# Altium schematic sheet [0X] - CPU - EIM.SchDoc
size A2
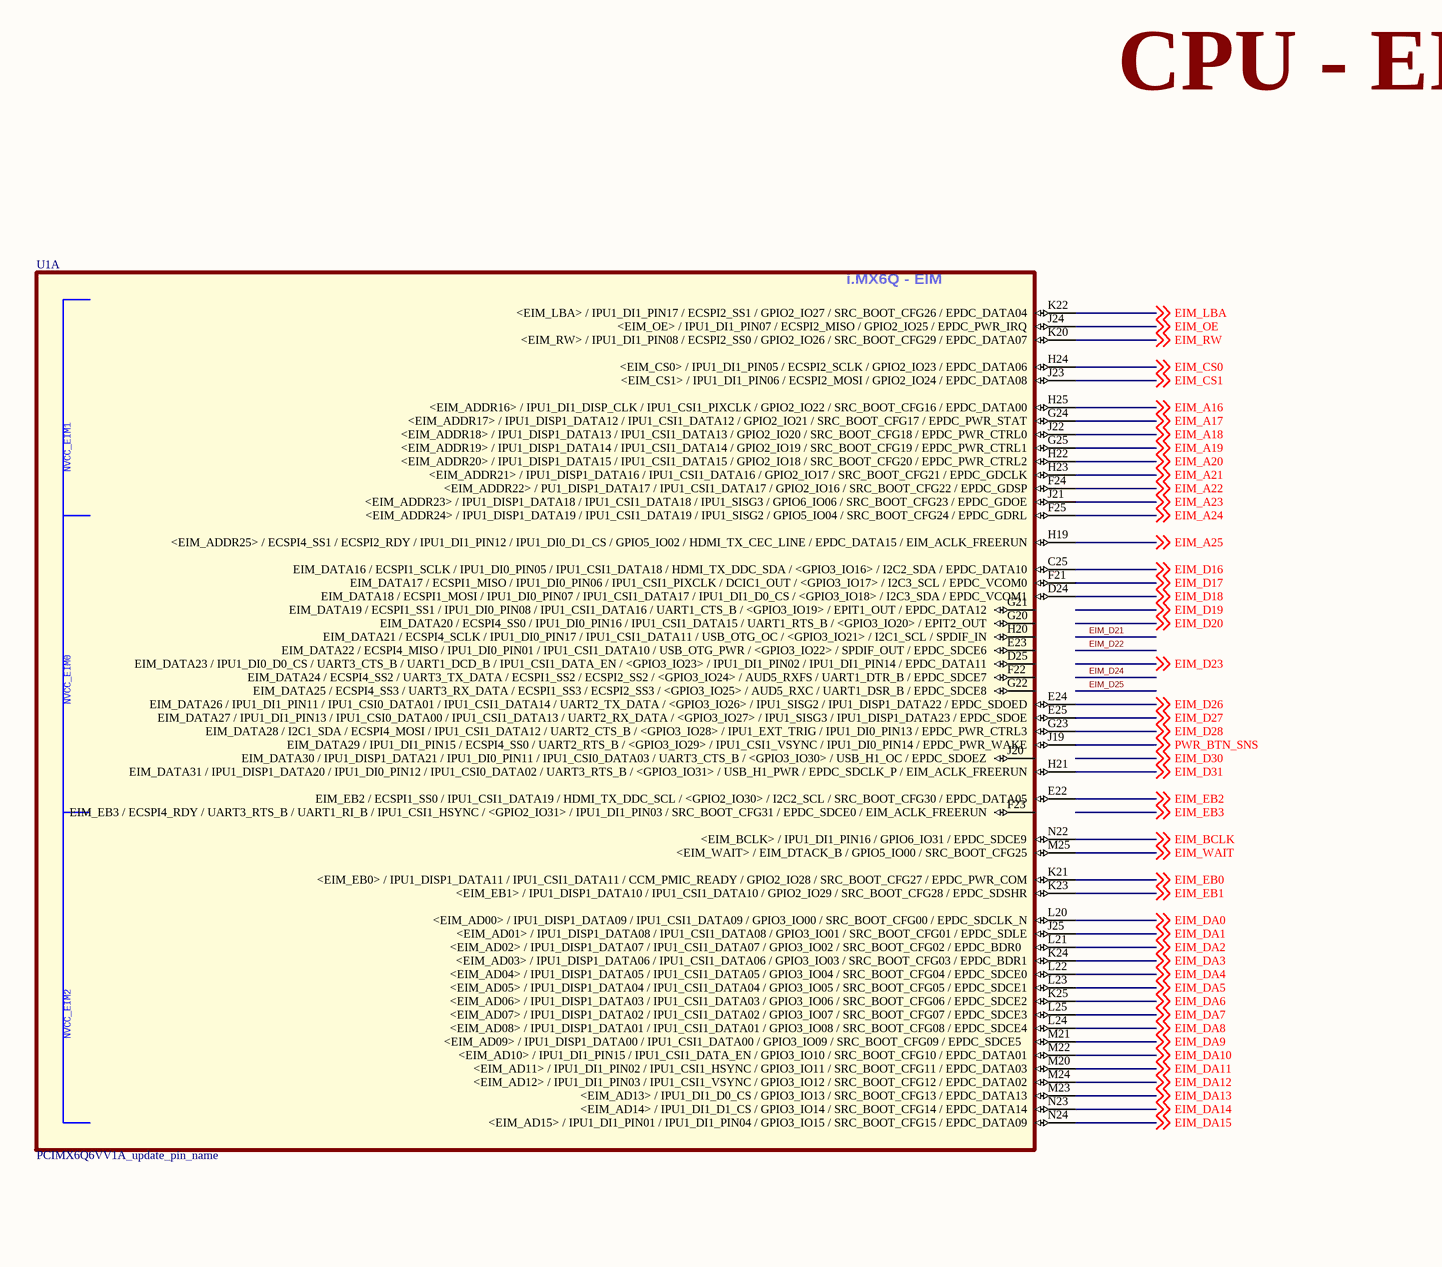
[diagram p0: [0X] - CPU - EIM.SchDoc, left]
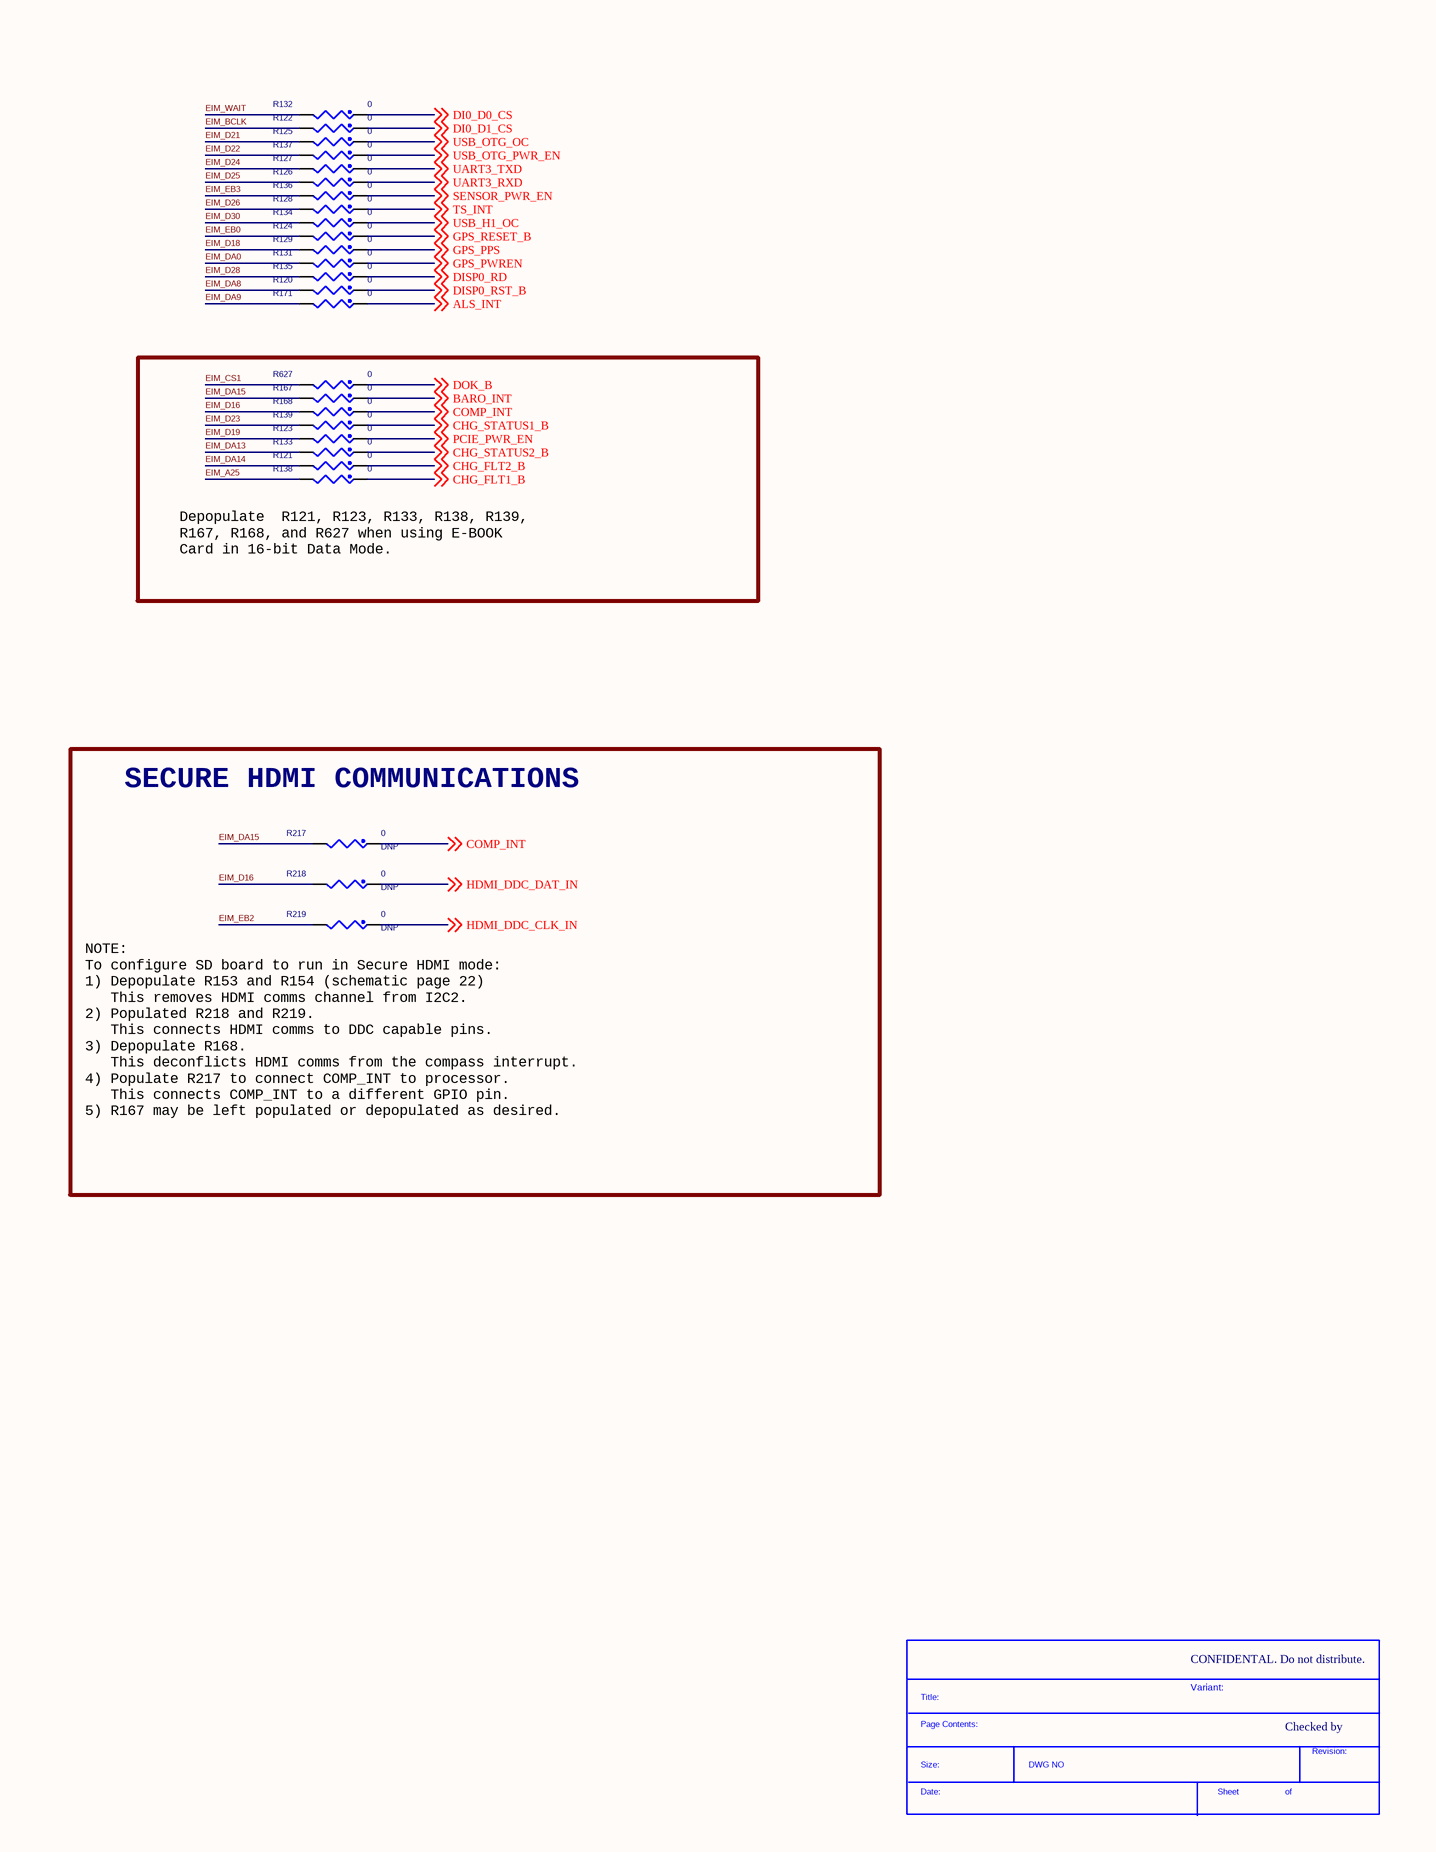
[diagram p1: [0X] - CPU - EIM.SchDoc, right]

## Parts
*  SDTitleBlock  (value not drawn)  (graphical)
R120  0  [0402_CC]
R121  0  [0402_CC]
R122  0  [0402_CC]
R123  0  [0402_CC]
R124  0  [0402_CC]
R125  0  [0402_CC]
R126  0  [0402_CC]
R127  0  [0402_CC]
R128  0  [0402_CC]
R129  0  [0402_CC]
R131  0  [0402_CC]
R132  0  [0402_CC]
R133  0  [0402_CC]
R134  0  [0402_CC]
R135  0  [0402_CC]
R136  0  [0402_CC]
R137  0  [0402_CC]
R138  0  [0402_CC]
R139  0  [0402_CC]
R167  0  [0402_CC]
R168  0  [0402_CC]
R171  0  [0402_CC]
R217  0  ASSY_OPT: DNP  [0402_CC]
R218  0  ASSY_OPT: DNP  [0402_CC]
R219  0  ASSY_OPT: DNP  [0402_CC]
R627  0  [0402_CC]
U1  PCIMX6Q6VV1A_update_pin_name  (part A of 17)

## Blocks framed on the sheet
SECURE HDMI COMMUNICATIONS: R217-R219

## Nets
ALS_INT: R171.1 ; off-sheet ALS_INT
BARO_INT: R167.1 ; off-sheet BARO_INT
CHG_FLT1_B: R138.1 ; off-sheet CHG_FLT1_B
CHG_FLT2_B: R121.1 ; off-sheet CHG_FLT2_B
CHG_STATUS1_B: R139.1 ; off-sheet CHG_STATUS1_B
CHG_STATUS2_B: R133.1 ; off-sheet CHG_STATUS2_B
COMP_INT: R168.1 R217.1 ; off-sheet COMP_INT
DI0_D0_CS: R132.1 ; off-sheet DI0_D0_CS
DI0_D1_CS: R122.1 ; off-sheet DI0_D1_CS
DISP0_RD: R135.1 ; off-sheet DISP0_RD
DISP0_RST_B: R120.1 ; off-sheet DISP0_RST_B
DOK_B: R627.1 ; off-sheet DOK_B
EIM_A16: U1.H25(<EIM_ADDR16>_/_IPU1_DI1_DISP_CLK_/_IPU1_CSI1_PIXCLK_/_GPIO2_IO22_/_SRC_BOOT_CFG16_/_EPDC_DATA00) ; off-sheet EIM_A16
EIM_A17: U1.G24(<EIM_ADDR17>_/_IPU1_DISP1_DATA12_/_IPU1_CSI1_DATA12_/_GPIO2_IO21_/_SRC_BOOT_CFG17_/_EPDC_PWR_STAT) ; off-sheet EIM_A17
EIM_A18: U1.J22(<EIM_ADDR18>_/_IPU1_DISP1_DATA13_/_IPU1_CSI1_DATA13_/_GPIO2_IO20_/_SRC_BOOT_CFG18_/_EPDC_PWR_CTRL0) ; off-sheet EIM_A18
EIM_A19: U1.G25(<EIM_ADDR19>_/_IPU1_DISP1_DATA14_/_IPU1_CSI1_DATA14_/_GPIO2_IO19_/_SRC_BOOT_CFG19_/_EPDC_PWR_CTRL1) ; off-sheet EIM_A19
EIM_A20: U1.H22(<EIM_ADDR20>_/_IPU1_DISP1_DATA15_/_IPU1_CSI1_DATA15_/_GPIO2_IO18_/_SRC_BOOT_CFG20_/_EPDC_PWR_CTRL2) ; off-sheet EIM_A20
EIM_A21: U1.H23(<EIM_ADDR21>_/_IPU1_DISP1_DATA16_/_IPU1_CSI1_DATA16_/_GPIO2_IO17_/_SRC_BOOT_CFG21_/_EPDC_GDCLK) ; off-sheet EIM_A21
EIM_A22: U1.F24(<EIM_ADDR22>_/_PU1_DISP1_DATA17_/_IPU1_CSI1_DATA17_/_GPIO2_IO16_/_SRC_BOOT_CFG22_/_EPDC_GDSP) ; off-sheet EIM_A22
EIM_A23: U1.J21(<EIM_ADDR23>_/_IPU1_DISP1_DATA18_/_IPU1_CSI1_DATA18_/_IPU1_SISG3_/_GPIO6_IO06_/_SRC_BOOT_CFG23_/_EPDC_GDOE) ; off-sheet EIM_A23
EIM_A24: U1.F25(<EIM_ADDR24>_/_IPU1_DISP1_DATA19_/_IPU1_CSI1_DATA19_/_IPU1_SISG2_/_GPIO5_IO04_/_SRC_BOOT_CFG24_/_EPDC_GDRL) ; off-sheet EIM_A24
EIM_A25: R138.2 U1.H19(<EIM_ADDR25>_/_ECSPI4_SS1_/_ECSPI2_RDY_/_IPU1_DI1_PIN12_/_IPU1_DI0_D1_CS_/_GPIO5_IO02_/_HDMI_TX_CEC_LINE_/_EPDC_DATA15_/_EIM_ACLK_FREERUN) ; off-sheet EIM_A25
EIM_BCLK: R122.2 U1.N22(<EIM_BCLK>_/_IPU1_DI1_PIN16_/_GPIO6_IO31_/_EPDC_SDCE9) ; off-sheet EIM_BCLK
EIM_CS0: U1.H24(<EIM_CS0>_/_IPU1_DI1_PIN05_/_ECSPI2_SCLK_/_GPIO2_IO23_/_EPDC_DATA06) ; off-sheet EIM_CS0
EIM_CS1: R627.2 U1.J23(<EIM_CS1>_/_IPU1_DI1_PIN06_/_ECSPI2_MOSI_/_GPIO2_IO24_/_EPDC_DATA08) ; off-sheet EIM_CS1
EIM_D16: R168.2 R218.2 U1.C25(EIM_DATA16_/_ECSPI1_SCLK_/_IPU1_DI0_PIN05_/_IPU1_CSI1_DATA18_/_HDMI_TX_DDC_SDA_/_<GPIO3_IO16>_/_I2C2_SDA_/_EPDC_DATA10) ; off-sheet EIM_D16
EIM_D17: U1.F21(EIM_DATA17_/_ECSPI1_MISO_/_IPU1_DI0_PIN06_/_IPU1_CSI1_PIXCLK_/_DCIC1_OUT_/_<GPIO3_IO17>_/_I2C3_SCL_/_EPDC_VCOM0) ; off-sheet EIM_D17
EIM_D18: R129.2 U1.D24(EIM_DATA18_/_ECSPI1_MOSI_/_IPU1_DI0_PIN07_/_IPU1_CSI1_DATA17_/_IPU1_DI1_D0_CS_/_<GPIO3_IO18>_/_I2C3_SDA_/_EPDC_VCOM1) ; off-sheet EIM_D18
EIM_D19: R123.2 ; off-sheet EIM_D19
EIM_D21: R125.2
EIM_D22: R137.2
EIM_D23: R139.2 ; off-sheet EIM_D23
EIM_D24: R127.2
EIM_D25: R126.2
EIM_D26: R128.2 U1.E24(EIM_DATA26_/_IPU1_DI1_PIN11_/_IPU1_CSI0_DATA01_/_IPU1_CSI1_DATA14_/_UART2_TX_DATA_/_<GPIO3_IO26>_/_IPU1_SISG2_/_IPU1_DISP1_DATA22_/_EPDC_SDOED) ; off-sheet EIM_D26
EIM_D27: U1.E25(EIM_DATA27_/_IPU1_DI1_PIN13_/_IPU1_CSI0_DATA00_/_IPU1_CSI1_DATA13_/_UART2_RX_DATA_/_<GPIO3_IO27>_/_IPU1_SISG3_/_IPU1_DISP1_DATA23_/_EPDC_SDOE) ; off-sheet EIM_D27
EIM_D28: R135.2 U1.G23(EIM_DATA28_/_I2C1_SDA_/_ECSPI4_MOSI_/_IPU1_CSI1_DATA12_/_UART2_CTS_B_/_<GPIO3_IO28>_/_IPU1_EXT_TRIG_/_IPU1_DI0_PIN13_/_EPDC_PWR_CTRL3) ; off-sheet EIM_D28
EIM_D30: R134.2 ; off-sheet EIM_D30
EIM_D31: U1.H21(EIM_DATA31_/_IPU1_DISP1_DATA20_/_IPU1_DI0_PIN12_/_IPU1_CSI0_DATA02_/_UART3_RTS_B_/_<GPIO3_IO31>_/_USB_H1_PWR_/_EPDC_SDCLK_P_/_EIM_ACLK_FREERUN) ; off-sheet EIM_D31
EIM_DA0: R131.2 U1.L20(<EIM_AD00>_/_IPU1_DISP1_DATA09_/_IPU1_CSI1_DATA09_/_GPIO3_IO00_/_SRC_BOOT_CFG00_/_EPDC_SDCLK_N) ; off-sheet EIM_DA0
EIM_DA1: U1.J25(<EIM_AD01>_/_IPU1_DISP1_DATA08_/_IPU1_CSI1_DATA08_/_GPIO3_IO01_/_SRC_BOOT_CFG01_/_EPDC_SDLE) ; off-sheet EIM_DA1
EIM_DA2: U1.L21(<EIM_AD02>_/_IPU1_DISP1_DATA07_/_IPU1_CSI1_DATA07_/_GPIO3_IO02_/_SRC_BOOT_CFG02_/_EPDC_BDR0) ; off-sheet EIM_DA2
EIM_DA3: U1.K24(<EIM_AD03>_/_IPU1_DISP1_DATA06_/_IPU1_CSI1_DATA06_/_GPIO3_IO03_/_SRC_BOOT_CFG03_/_EPDC_BDR1) ; off-sheet EIM_DA3
EIM_DA4: U1.L22(<EIM_AD04>_/_IPU1_DISP1_DATA05_/_IPU1_CSI1_DATA05_/_GPIO3_IO04_/_SRC_BOOT_CFG04_/_EPDC_SDCE0) ; off-sheet EIM_DA4
EIM_DA5: U1.L23(<EIM_AD05>_/_IPU1_DISP1_DATA04_/_IPU1_CSI1_DATA04_/_GPIO3_IO05_/_SRC_BOOT_CFG05_/_EPDC_SDCE1) ; off-sheet EIM_DA5
EIM_DA6: U1.K25(<EIM_AD06>_/_IPU1_DISP1_DATA03_/_IPU1_CSI1_DATA03_/_GPIO3_IO06_/_SRC_BOOT_CFG06_/_EPDC_SDCE2) ; off-sheet EIM_DA6
EIM_DA7: U1.L25(<EIM_AD07>_/_IPU1_DISP1_DATA02_/_IPU1_CSI1_DATA02_/_GPIO3_IO07_/_SRC_BOOT_CFG07_/_EPDC_SDCE3) ; off-sheet EIM_DA7
EIM_DA8: R120.2 U1.L24(<EIM_AD08>_/_IPU1_DISP1_DATA01_/_IPU1_CSI1_DATA01_/_GPIO3_IO08_/_SRC_BOOT_CFG08_/_EPDC_SDCE4) ; off-sheet EIM_DA8
EIM_DA9: R171.2 U1.M21(<EIM_AD09>_/_IPU1_DISP1_DATA00_/_IPU1_CSI1_DATA00_/_GPIO3_IO09_/_SRC_BOOT_CFG09_/_EPDC_SDCE5) ; off-sheet EIM_DA9
EIM_DA10: U1.M22(<EIM_AD10>_/_IPU1_DI1_PIN15_/_IPU1_CSI1_DATA_EN_/_GPIO3_IO10_/_SRC_BOOT_CFG10_/_EPDC_DATA01) ; off-sheet EIM_DA10
EIM_DA11: U1.M20(<EIM_AD11>_/_IPU1_DI1_PIN02_/_IPU1_CSI1_HSYNC_/_GPIO3_IO11_/_SRC_BOOT_CFG11_/_EPDC_DATA03) ; off-sheet EIM_DA11
EIM_DA12: U1.M24(<EIM_AD12>_/_IPU1_DI1_PIN03_/_IPU1_CSI1_VSYNC_/_GPIO3_IO12_/_SRC_BOOT_CFG12_/_EPDC_DATA02) ; off-sheet EIM_DA12
EIM_DA13: R133.2 U1.M23(<EIM_AD13>_/_IPU1_DI1_D0_CS_/_GPIO3_IO13_/_SRC_BOOT_CFG13_/_EPDC_DATA13) ; off-sheet EIM_DA13
EIM_DA14: R121.2 U1.N23(<EIM_AD14>_/_IPU1_DI1_D1_CS_/_GPIO3_IO14_/_SRC_BOOT_CFG14_/_EPDC_DATA14) ; off-sheet EIM_DA14
EIM_DA15: R167.2 R217.2 U1.N24(<EIM_AD15>_/_IPU1_DI1_PIN01_/_IPU1_DI1_PIN04_/_GPIO3_IO15_/_SRC_BOOT_CFG15_/_EPDC_DATA09) ; off-sheet EIM_DA15
EIM_EB0: R124.2 U1.K21(<EIM_EB0>_/_IPU1_DISP1_DATA11_/_IPU1_CSI1_DATA11_/_CCM_PMIC_READY_/_GPIO2_IO28_/_SRC_BOOT_CFG27_/_EPDC_PWR_COM) ; off-sheet EIM_EB0
EIM_EB1: U1.K23(<EIM_EB1>_/_IPU1_DISP1_DATA10_/_IPU1_CSI1_DATA10_/_GPIO2_IO29_/_SRC_BOOT_CFG28_/_EPDC_SDSHR) ; off-sheet EIM_EB1
EIM_EB2: R219.2 U1.E22(EIM_EB2_/_ECSPI1_SS0_/_IPU1_CSI1_DATA19_/_HDMI_TX_DDC_SCL_/_<GPIO2_IO30>_/_I2C2_SCL_/_SRC_BOOT_CFG30_/_EPDC_DATA05) ; off-sheet EIM_EB2
EIM_EB3: R136.2 ; off-sheet EIM_EB3
EIM_LBA: U1.K22(<EIM_LBA>_/_IPU1_DI1_PIN17_/_ECSPI2_SS1_/_GPIO2_IO27_/_SRC_BOOT_CFG26_/_EPDC_DATA04) ; off-sheet EIM_LBA
EIM_OE: U1.J24(<EIM_OE>_/_IPU1_DI1_PIN07_/_ECSPI2_MISO_/_GPIO2_IO25_/_EPDC_PWR_IRQ) ; off-sheet EIM_OE
EIM_RW: U1.K20(<EIM_RW>_/_IPU1_DI1_PIN08_/_ECSPI2_SS0_/_GPIO2_IO26_/_SRC_BOOT_CFG29_/_EPDC_DATA07) ; off-sheet EIM_RW
EIM_WAIT: R132.2 U1.M25(<EIM_WAIT>_/_EIM_DTACK_B_/_GPIO5_IO00_/_SRC_BOOT_CFG25) ; off-sheet EIM_WAIT
GPS_PPS: R129.1 ; off-sheet GPS_PPS
GPS_PWREN: R131.1 ; off-sheet GPS_PWREN
GPS_RESET_B: R124.1 ; off-sheet GPS_RESET_B
HDMI_DDC_CLK_IN: R219.1 ; off-sheet HDMI_DDC_CLK_IN
HDMI_DDC_DAT_IN: R218.1 ; off-sheet HDMI_DDC_DAT_IN
PCIE_PWR_EN: R123.1 ; off-sheet PCIE_PWR_EN
PWR_BTN_SNS: U1.J19(EIM_DATA29_/_IPU1_DI1_PIN15_/_ECSPI4_SS0_/_UART2_RTS_B_/_<GPIO3_IO29>_/_IPU1_CSI1_VSYNC_/_IPU1_DI0_PIN14_/_EPDC_PWR_WAKE) ; off-sheet PWR_BTN_SNS
SENSOR_PWR_EN: R136.1 ; off-sheet SENSOR_PWR_EN
TS_INT: R128.1 ; off-sheet TS_INT
UART3_RXD: R126.1 ; off-sheet UART3_RXD
UART3_TXD: R127.1 ; off-sheet UART3_TXD
USB_H1_OC: R134.1 ; off-sheet USB_H1_OC
USB_OTG_OC: R125.1 ; off-sheet USB_OTG_OC
USB_OTG_PWR_EN: R137.1 ; off-sheet USB_OTG_PWR_EN

Not connected (* = marked no-connect by the designer): U1 D25(EIM_DATA23_/_IPU1_DI0_D0_CS_/_UART3_CTS_B_/_UART1_DCD_B_/_IPU1_CSI1_DATA_EN_/_<GPIO3_IO23>_/_IPU1_DI1_PIN02_/_IPU1_DI1_PIN14_/_EPDC_DATA11) E23(__EIM_DATA22_/_ECSPI4_MISO_/_IPU1_DI0_PIN01_/_IPU1_CSI1_DATA10_/_USB_OTG_PWR_/_<GPIO3_IO22>_/_SPDIF_OUT_/_EPDC_SDCE6) F22(__EIM_DATA24_/_ECSPI4_SS2_/_UART3_TX_DATA_/_ECSPI1_SS2_/_ECSPI2_SS2_/_<GPIO3_IO24>_/_AUD5_RXFS_/_UART1_DTR_B_/_EPDC_SDCE7) F23(EIM_EB3_/_ECSPI4_RDY_/_UART3_RTS_B_/_UART1_RI_B_/_IPU1_CSI1_HSYNC_/_<GPIO2_IO31>_/_IPU1_DI1_PIN03_/_SRC_BOOT_CFG31_/_EPDC_SDCE0_/_EIM_ACLK_FREERUN) G20(EIM_DATA20_/_ECSPI4_SS0_/_IPU1_DI0_PIN16_/_IPU1_CSI1_DATA15_/_UART1_RTS_B_/_<GPIO3_IO20>_/_EPIT2_OUT) G21(__EIM_DATA19_/_ECSPI1_SS1_/_IPU1_DI0_PIN08_/_IPU1_CSI1_DATA16_/_UART1_CTS_B_/_<GPIO3_IO19>_/_EPIT1_OUT_/_EPDC_DATA12) G22(__EIM_DATA25_/_ECSPI4_SS3_/_UART3_RX_DATA_/_ECSPI1_SS3_/_ECSPI2_SS3_/_<GPIO3_IO25>_/_AUD5_RXC_/_UART1_DSR_B_/_EPDC_SDCE8) H20(EIM_DATA21_/_ECSPI4_SCLK_/_IPU1_DI0_PIN17_/_IPU1_CSI1_DATA11_/_USB_OTG_OC_/_<GPIO3_IO21>_/_I2C1_SCL_/_SPDIF_IN) J20(__EIM_DATA30_/_IPU1_DISP1_DATA21_/_IPU1_DI0_PIN11_/_IPU1_CSI0_DATA03_/_UART3_CTS_B_/_<GPIO3_IO30>_/_USB_H1_OC_/_EPDC_SDOEZ)

## Notes on the sheet
- CPU - EIM
- Depopulate  R121, R123, R133, R138, R139,
  R167, R168, and R627 when using E-BOOK
  Card in 16-bit Data Mode.
- (near R219) NOTE:
  To configure SD board to run in Secure HDMI mode:
  1) Depopulate R153 and R154 (schematic page 22)
  This removes HDMI comms channel from I2C2.
  2) Populated R218 and R219.
  This connects HDMI comms to DDC capable pins.
  3) Depopulate R168.
  This deconflicts HDMI comms from the compass interrupt.
  4) Populate R217 to connect COMP_INT to processor.
  This connects COMP_INT to a different GPIO pin.
  5) R167 may be left populated or depopulated as desired.
- CONFIDENTAL. Do not distribute.
- Variant:
- Checked by
- (in symbol PCIMX6Q6VV1A_update_pin_name, part A) i.MX6Q - EIM
- (in symbol SDTitleBlock) Title:; Page Contents:; Revision:; Size:; DWG NO; Date:; Sheet; of

## Library data of the parts
R120 R121 R124 R127-R129 R131 R133 R135 R138 R139 R167 = RES: RES MF ZERO OHM 1/10W -- 0402; CLASS: DISCRETE; AGILE_PN: 470-79965; MFG_NAME01: Panasonic; MFG_PN01: ERJ-2GE0R00X; CAD_APPROVED: Yes; FPLIST: RC0402_25,RC0402_HD,RC0402_X2,0402_CC; SIGNAL_MODEL: DEFAULT_RESISTOR_0.001OHM_2_1; ROHS: Yes
R122 R123 R125 R126 R132 R134 R136 R137 R168 R171 R217-R219 R627 = RES: RES MF ZERO OHM 1/10W -- 0402; CLASS: DISCRETE; FPLIST: RC0402_25,RC0402_HD,RC0402_X2,0402_CC; CAD_APPROVED: Yes; MFG_PN01: ERJ-2GE0R00X; MFG_NAME01: Panasonic; AGILE_PN: 470-79965; SIGNAL_MODEL: DEFAULT_RESISTOR_0.001OHM_2_1; ROHS: Yes
U1 = PCIMX6Q6VV1A_update_pin_name: CLASS: IC